# Altium schematic sheet mcu.SchDoc
size A3
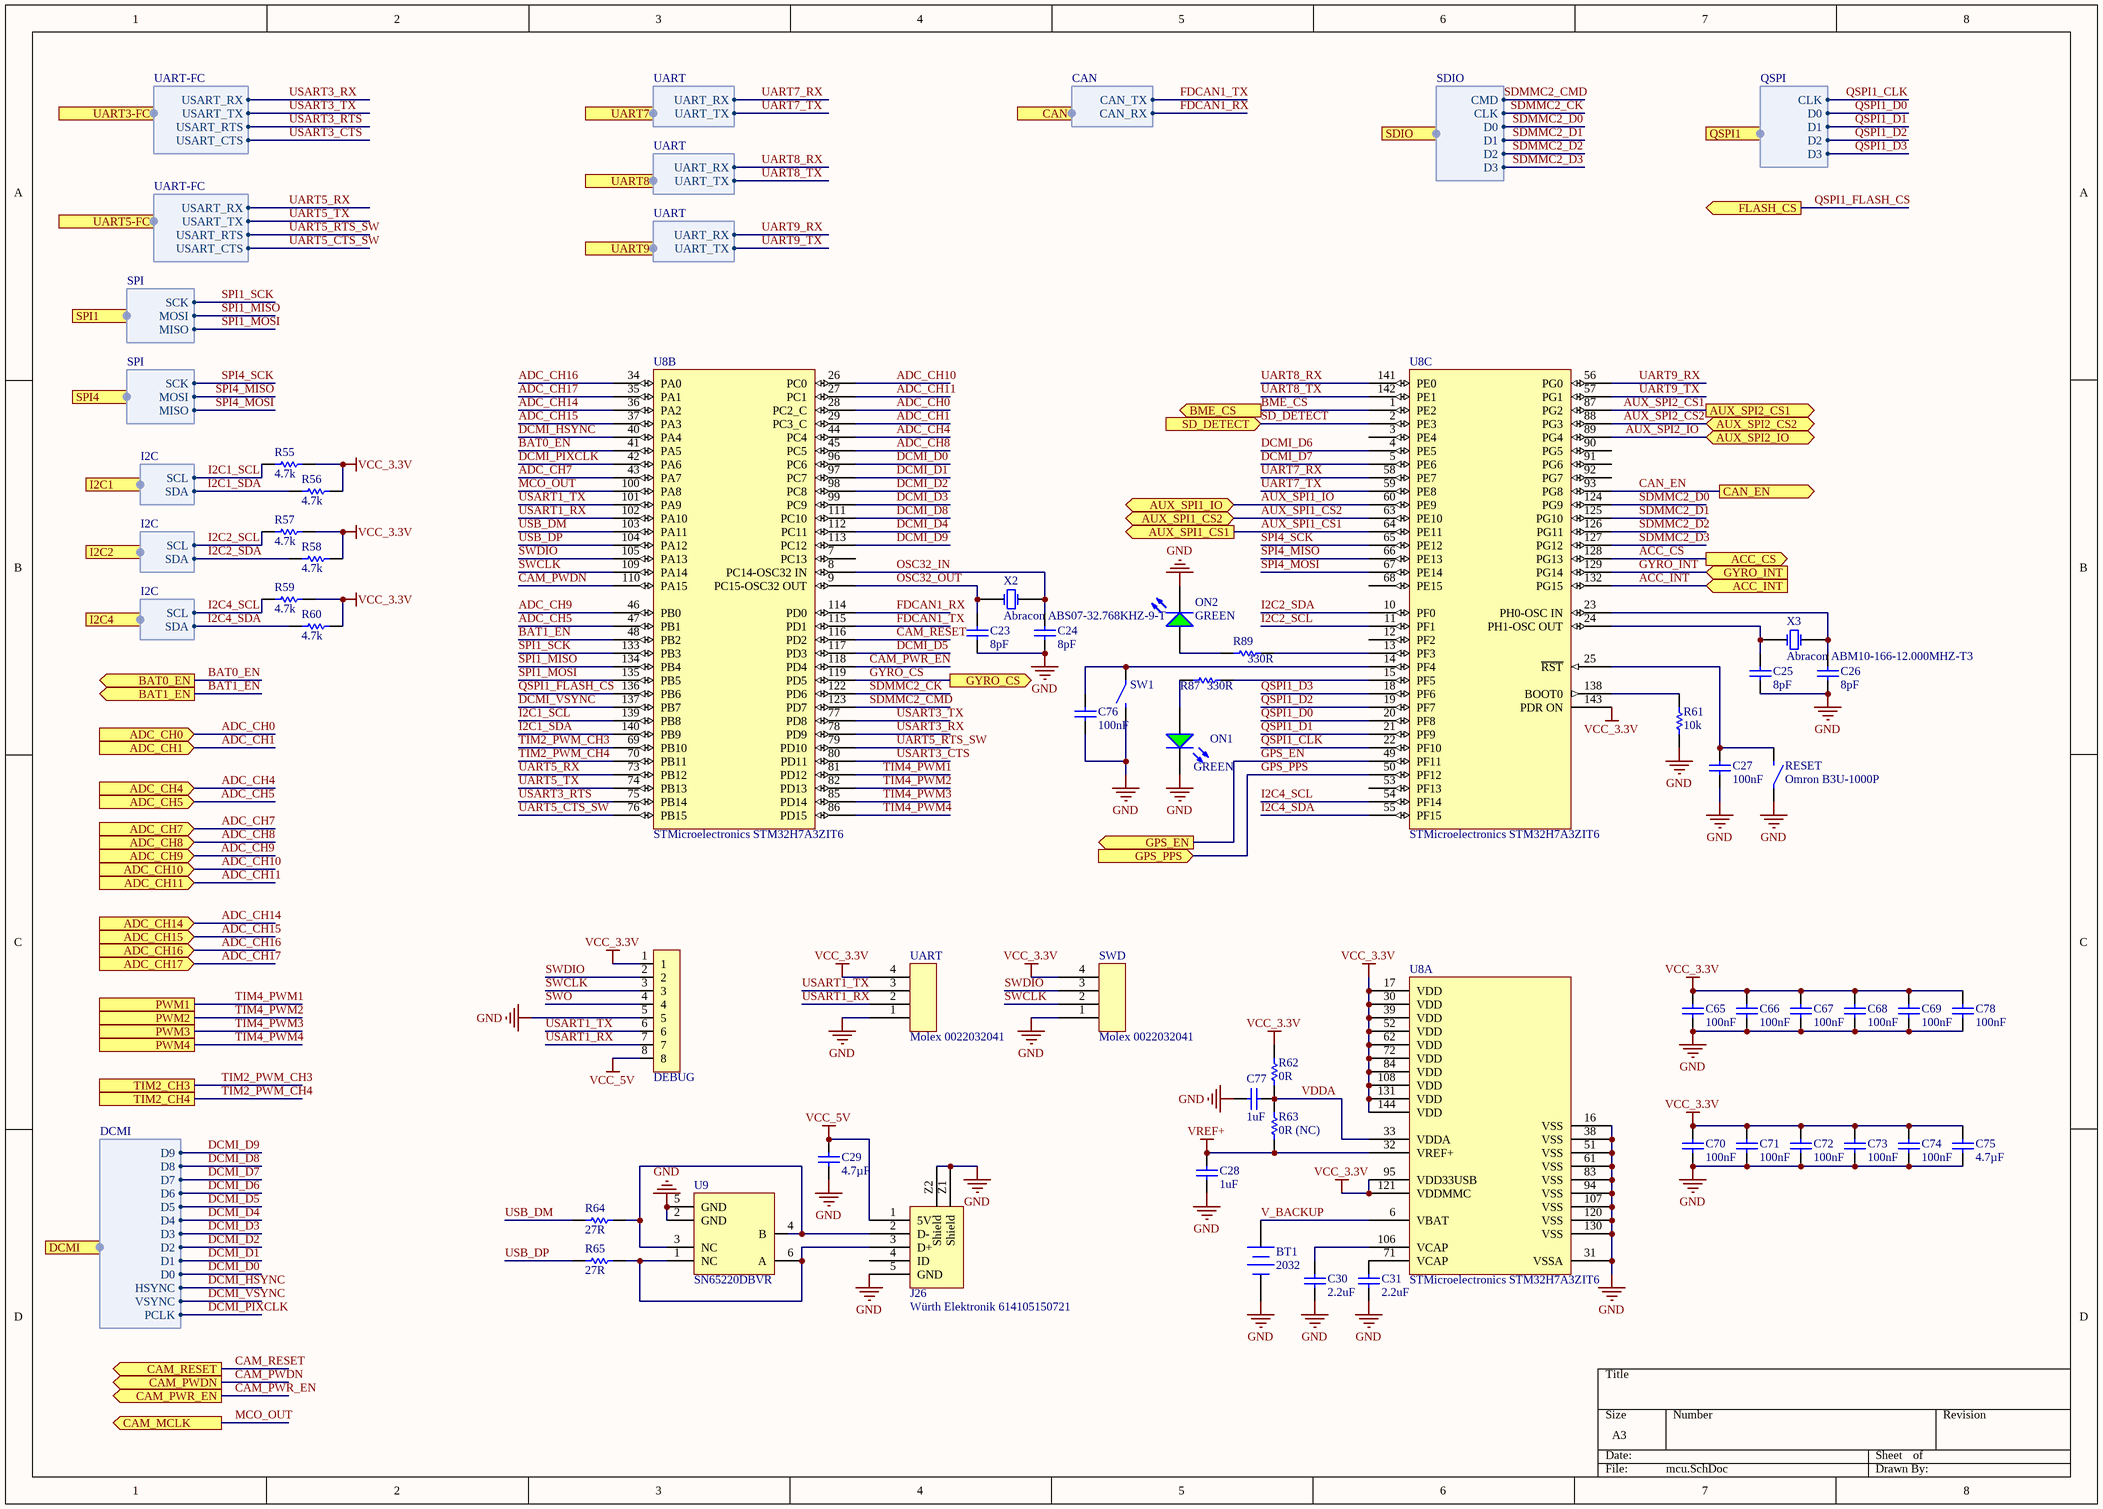
[diagram p0: mcu.SchDoc]

## Parts
BT1  2032  [PCB-u4kor45r34oj4lfal23t-1]
C23  8pF  [CAPC1005X55X25NL05T10]
C24  8pF  [CAPC1005X55X25NL05T10]
C25  8pF  [CAPC1005X55X25NL05T10]
C26  8pF  [CAPC1005X55X25NL05T10]
C27  100nF  [CAPC1005X56X25NL10T15]
C28  1uF  [CAPC1005X60X30LL05T10]
C29  4.7µF  [CAPC1608X90X35NL15T15]
C30  2.2uF  [CAPC1005X56X25LL10T15]
C31  2.2uF  [CAPC1005X56X25LL10T15]
C65  100nF  [CAPC1005X56X25NL10T15]
C66  100nF  [CAPC1005X56X25NL10T15]
C67  100nF  [CAPC1005X56X25NL10T15]
C68  100nF  [CAPC1005X56X25NL10T15]
C69  100nF  [CAPC1005X56X25NL10T15]
C70  100nF  [CAPC1005X56X25NL10T15]
C71  100nF  [CAPC1005X56X25NL10T15]
C72  100nF  [CAPC1005X56X25NL10T15]
C73  100nF  [CAPC1005X56X25NL10T15]
C74  100nF  [CAPC1005X56X25NL10T15]
C75  4.7µF  [CAPC1608X90X35NL15T15]
C76  100nF  [CAPC1005X56X25NL10T15]
C77  1uF  [CAPC1005X60X30LL05T10]
C78  100nF  [CAPC1005X56X25NL10T15]
DEBUG  FCI HLW8R-2C7LF  [PCB-9fz4gdy3o615agpn7s9f-1]  (value not drawn)
J26  Würth Elektronik 614105150721  [USB connector B]
ON1  GREEN  [LED-0603_D]
ON2  GREEN  [LED-0603_D]
R55  4.7k  [RESC1005X40X25NL10T10]
R56  4.7k  [RESC1005X40X25NL10T10]
R57  4.7k  [RESC1005X40X25NL10T10]
R58  4.7k  [RESC1005X40X25NL10T10]
R59  4.7k  [RESC1005X40X25NL10T10]
R60  4.7k  [RESC1005X40X25NL10T10]
R61  10k  [RESC1005X40X25NL05T10]
R62  0R  [PCB-azzhouwj1h0sqqpj65ny-1]
R63  0R (NC)  [PCB-azzhouwj1h0sqqpj65ny-1]
R64  27R  [RESC1005X40X25NL05T05]
R65  27R  [RESC1005X40X25NL05T05]
R87  330R  [PCB-gqq469mmsoijq124jywu-1]
R89  330R  [PCB-gqq469mmsoijq124jywu-1]
RESET  Omron B3U-1000P  [PCB-a8ildroimidtkya2dspy-1]
SW1  Omron B3U-1000P  [PCB-a8ildroimidtkya2dspy-1]  (value not drawn)
SWD  Molex 0022032041  [PCB-w7fgx0p37qyww1etoafk-1]
U8  STMicroelectronics STM32H7A3ZIT6  [PCB-qnuz4odb3kjwuv0h32wq-1]  (parts A,B,C of 3)
U9  SN65220DBVR  [DBV6_M]
UART  Molex 0022032041  [PCB-w7fgx0p37qyww1etoafk-1]
X2  Abracon ABS07-32.768KHZ-9-T  [CAPC3215X09N]
X3  Abracon ABM10-166-12.000MHZ-T3  [PCBComponent_1 - duplicate]

## Ports
ACC_CS (out), ACC_INT (in), ADC_CH0 (in), ADC_CH1 (in), ADC_CH4 (in), ADC_CH5 (in), ADC_CH7 (in), ADC_CH8 (in), ADC_CH9 (in), ADC_CH10 (in), ADC_CH11 (in), ADC_CH14 (in), ADC_CH15 (in), ADC_CH16 (in), ADC_CH17 (in), AUX_SPI1_CS1 (out), AUX_SPI1_CS2 (bidir), AUX_SPI1_IO (bidir), AUX_SPI2_CS1 (out), AUX_SPI2_CS2 (bidir), AUX_SPI2_IO (bidir), BAT0_EN (out), BAT1_EN (out), BME_CS (out), CAM_MCLK (out), CAM_PWDN (out), CAM_PWR_EN (out), CAM_RESET (out), CAN (harness CAN), CAN_EN (out), DCMI (harness DCMI), FLASH_CS (out), GPS_EN (out), GPS_PPS (in), GYRO_CS (out), GYRO_INT (in), I2C1 (harness I2C), I2C2 (harness I2C), I2C4 (harness I2C), PWM1, PWM2, PWM3, PWM4, QSPI1 (harness QSPI), SD_DETECT (in), SDIO (harness SDIO), SPI1 (harness SPI), SPI4 (harness SPI), TIM2_CH3, TIM2_CH4, UART3-FC (harness UART-FC), UART5-FC (harness UART-FC), UART7 (harness UART), UART8 (harness UART), UART9 (harness UART)

## Harnesses
DCMI: PCLK, VSYNC, HSYNC, D0, D1, D2, D3, D4, D5, D6, D7, D8, D9
I2C: SCL, SDA
SPI: MOSI, MISO, SCK
UART-FC: USART_TX, USART_RX, USART_CTS, USART_RTS
UART: UART_TX, UART_RX
CAN: CAN_TX, CAN_RX
SDIO: CLK, CMD, D0, D1, D2, D3
QSPI: CLK, D0, D1, D2, D3

## Nets
GND: BT1.2(-) C23.2 C24.2 C25.2 C26.2 C27.1 C28.1 C29.2 C30.1 C31.1 C65.2 C66.2 C67.2 C68.2 C69.2 C70.2 C71.2 C72.2 C73.2 C74.2 C75.1 C76.1 C77.2 C78.2 DEBUG.5 J26.5(GND) J26.Z1(Shield) J26.Z2(Shield) ON1.C ON2.C R61.1 RESET.1 SW1.2 SWD.1 U8.16(VSS) U8.31(VSSA) U8.38(VSS) U8.51(VSS) U8.61(VSS) U8.83(VSS) U8.94(VSS) U8.107(VSS) U8.120(VSS) U8.130(VSS) U9.2(GND) U9.5(GND) UART.1
VCC_3.3V: C65.1 C66.1 C67.1 C68.1 C69.1 C70.1 C71.1 C72.1 C73.1 C74.1 C75.2 C78.1 DEBUG.1 R55.2 R56.2 R57.2 R58.2 R59.2 R60.2 R62.2 SWD.4 U8.17(VDD) U8.30(VDD) U8.39(VDD) U8.52(VDD) U8.62(VDD) U8.72(VDD) U8.84(VDD) U8.95(VDD33USB) U8.108(VDD) U8.121(VDDMMC) U8.131(VDD) U8.143(PDR_ON) U8.144(VDD) UART.4
VCC_5V: C29.1 DEBUG.8 J26.1(5V)
VREF+: C28.2 R63.2 U8.32(VREF+)
ACC_CS: U8.128(PG13) ; port ACC_CS
ACC_INT: U8.132(PG15) ; port ACC_INT
ADC_CH0: U8.28(PC2_C) ; port ADC_CH0
ADC_CH1: U8.29(PC3_C) ; port ADC_CH1
ADC_CH4: U8.44(PC4) ; port ADC_CH4
ADC_CH5: U8.47(PB1) ; port ADC_CH5
ADC_CH7: U8.43(PA7) ; port ADC_CH7
ADC_CH8: U8.45(PC5) ; port ADC_CH8
ADC_CH9: U8.46(PB0) ; port ADC_CH9
ADC_CH10: U8.26(PC0) ; port ADC_CH10
ADC_CH11: U8.27(PC1) ; port ADC_CH11
ADC_CH14: U8.36(PA2) ; port ADC_CH14
ADC_CH15: U8.37(PA3) ; port ADC_CH15
ADC_CH16: U8.34(PA0) ; port ADC_CH16
ADC_CH17: U8.35(PA1) ; port ADC_CH17
AUX_SPI1_CS1: U8.64(PE11) ; port AUX_SPI1_CS1
AUX_SPI1_CS2: U8.63(PE10) ; port AUX_SPI1_CS2
AUX_SPI1_IO: U8.60(PE9) ; port AUX_SPI1_IO
AUX_SPI2_CS1: U8.87(PG2) ; port AUX_SPI2_CS1
AUX_SPI2_CS2: U8.88(PG3) ; port AUX_SPI2_CS2
AUX_SPI2_IO: U8.89(PG4) ; port AUX_SPI2_IO
BAT0_EN: U8.41(PA5) ; port BAT0_EN
BAT1_EN: U8.48(PB2) ; port BAT1_EN
BME_CS: U8.1(PE2) ; port BME_CS
CAM_PWDN: U8.110(PA15) ; port CAM_PWDN
CAM_PWR_EN: U8.118(PD4) ; port CAM_PWR_EN
CAM_RESET: U8.116(PD2) ; port CAM_RESET
CAN_EN: U8.93(PG8) ; port CAN_EN
DCMI_D0: U8.96(PC6) ; port DCMI.D0
DCMI_D1: U8.97(PC7) ; port DCMI.D1
DCMI_D2: U8.98(PC8) ; port DCMI.D2
DCMI_D3: U8.99(PC9) ; port DCMI.D3
DCMI_D4: U8.112(PC11) ; port DCMI.D4
DCMI_D5: U8.117(PD3) ; port DCMI.D5
DCMI_D6: U8.4(PE5) ; port DCMI.D6
DCMI_D7: U8.5(PE6) ; port DCMI.D7
DCMI_D8: U8.111(PC10) ; port DCMI.D8
DCMI_D9: U8.113(PC12) ; port DCMI.D9
DCMI_HSYNC: U8.40(PA4) ; port DCMI.HSYNC
DCMI_PIXCLK: U8.42(PA6) ; port DCMI.PCLK
DCMI_VSYNC: U8.137(PB7) ; port DCMI.VSYNC
FDCAN1_RX: U8.114(PD0) ; port CAN.CAN_RX
FDCAN1_TX: U8.115(PD1) ; port CAN.CAN_TX
GPS_EN: U8.49(PF11) ; port GPS_EN
GPS_PPS: U8.50(PF12) ; port GPS_PPS
GYRO_CS: U8.119(PD5) ; port GYRO_CS
GYRO_INT: U8.129(PG14) ; port GYRO_INT
I2C1_SCL: R55.1 U8.139(PB8) ; port I2C1.SCL
I2C1_SDA: R56.1 U8.140(PB9) ; port I2C1.SDA
I2C2_SCL: R57.1 U8.11(PF1) ; port I2C2.SCL
I2C2_SDA: R58.1 U8.10(PF0) ; port I2C2.SDA
I2C4_SCL: R59.1 U8.54(PF14) ; port I2C4.SCL
I2C4_SDA: R60.1 U8.55(PF15) ; port I2C4.SDA
MCO_OUT: U8.100(PA8) ; port CAM_MCLK
OSC32_IN: C24.1 U8.8(PC14-OSC32_IN) X2.2(X2)
OSC32_OUT: C23.1 U8.9(PC15-OSC32_OUT) X2.1(X1)
QSPI1_CLK: U8.22(PF10) ; port QSPI1.CLK
QSPI1_D0: U8.20(PF8) ; port QSPI1.D0
QSPI1_D1: U8.21(PF9) ; port QSPI1.D1
QSPI1_D2: U8.19(PF7) ; port QSPI1.D2
QSPI1_D3: U8.18(PF6) ; port QSPI1.D3
QSPI1_FLASH_CS: U8.136(PB6) ; port FLASH_CS
SD_DETECT: U8.2(PE3) ; port SD_DETECT
SDMMC2_CK: U8.122(PD6) ; port SDIO.CLK
SDMMC2_CMD: U8.123(PD7) ; port SDIO.CMD
SDMMC2_D0: U8.124(PG9) ; port SDIO.D0
SDMMC2_D1: U8.125(PG10) ; port SDIO.D1
SDMMC2_D2: U8.126(PG11) ; port SDIO.D2
SDMMC2_D3: U8.127(PG12) ; port SDIO.D3
SPI1_MISO: U8.134(PB4) ; port SPI1.MOSI
SPI1_MOSI: U8.135(PB5) ; port SPI1.MISO
SPI1_SCK: U8.133(PB3) ; port SPI1.SCK
SPI4_MISO: U8.66(PE13) ; port SPI4.MOSI
SPI4_MOSI: U8.67(PE14) ; port SPI4.MISO
SPI4_SCK: U8.65(PE12) ; port SPI4.SCK
SWCLK: DEBUG.3 SWD.2 U8.109(PA14)
SWDIO: DEBUG.2 SWD.3 U8.105(PA13)
SWO: DEBUG.4
TIM2_PWM_CH3: U8.69(PB10) ; port TIM2_CH3
TIM2_PWM_CH4: U8.70(PB11) ; port TIM2_CH4
TIM4_PWM1: U8.81(PD12) ; port PWM1
TIM4_PWM2: U8.82(PD13) ; port PWM2
TIM4_PWM3: U8.85(PD14) ; port PWM3
TIM4_PWM4: U8.86(PD15) ; port PWM4
UART5_CTS_SW: U8.76(PB15) ; port UART5-FC.USART_CTS
UART5_RTS_SW: U8.79(PD10) ; port UART5-FC.USART_RTS
UART5_RX: U8.73(PB12) ; port UART5-FC.USART_RX
UART5_TX: U8.74(PB13) ; port UART5-FC.USART_TX
UART7_RX: U8.58(PE7) ; port UART7.UART_RX
UART7_TX: U8.59(PE8) ; port UART7.UART_TX
UART8_RX: U8.141(PE0) ; port UART8.UART_RX
UART8_TX: U8.142(PE1) ; port UART8.UART_TX
UART9_RX: U8.56(PG0) ; port UART9.UART_RX
UART9_TX: U8.57(PG1) ; port UART9.UART_TX
USART1_RX: DEBUG.7 U8.102(PA10) UART.2
USART1_TX: DEBUG.6 U8.101(PA9) UART.3
USART3_CTS: U8.80(PD11) ; port UART3-FC.USART_CTS
USART3_RTS: U8.75(PB14) ; port UART3-FC.USART_RTS
USART3_RX: U8.78(PD9) ; port UART3-FC.USART_RX
USART3_TX: U8.77(PD8) ; port UART3-FC.USART_TX
USB_DM: R64.1 U8.103(PA11)
USB_DP: R65.1 U8.104(PA12)
V_BACKUP: BT1.1(+) U8.6(VBAT)
VDDA: C77.1 R62.1 R63.1 U8.33(VDDA)
NetC25_1: C25.1 U8.24(PH1-OSC_OUT) X3.3(X2)
NetC26_1: C26.1 U8.23(PH0-OSC_IN) X3.1(X1)
NetC27_2: C27.2 RESET.2 U8.25(~{RST})
NetC30_2: C30.2 U8.106(VCAP)
NetC31_2: C31.2 U8.71(VCAP)
NetC76_2: C76.2 SW1.1 U8.14(PF4)
NetJ26_2: J26.2(D-) R64.2 U9.3(NC) U9.4(B)
NetJ26_3: J26.3(D+) R65.2 U9.1(NC) U9.6(A)
NetON1_A: ON1.A R87.2
NetON2_A: ON2.A R89.2
NetR61_2: R61.2 U8.138(BOOT0)
NetR87_1: R87.1 U8.15(PF5)
NetR89_1: R89.1 U8.13(PF3)

Not connected (* = marked no-connect by the designer): J26 4(ID); U8 3(PE4) 7(PC13) 12(PF2) 53(PF13) 68(PE15) 90(PG5) 91(PG6) 92(PG7)

## Library data of the parts
BT1 = CMP-19301741-10: Coin Cell Battery Holders 20MM (2032) SMT CELL HOLDER
C23-C26 = CMP-137744-2: CAP CER 8PF 50V NP0 0402; Manufacturer Part Number: GJM1555C1H8R0WB01D; Capacitance: 8e-12 F; Dielectric Characteristic: C0G/NP0; Voltage Rating (DC): 50.0 V; Octopart Url: https://octopart.com/gjm1555c1h8r0wb01d-murata-18142773; OctopartID: 2584ed9ad6d7fa43; RoHS: Compliant; Size-Length: 0.001 m; Size-Thickness: 0.0005 m; Size-Width: 0.0005 m
C27 C65-C74 C76 C78 = CMP-bf2276a55d9a60e5-19: Ceramic capacitor SMD-0402 100nF /16V X7R# K +-10%, Samsung, RoHS; Dielectric Characteristic: X7R; Lead-Free Status: Lead Free; Mounting Style: Surface Mount; Capacitance: 100 nF; Case/Package: 0402; OctopartID: 0755ced2c795d892
C28 C77 = CMP-8752271-2: Cap Ceramic 1uF 10V X5R 10% SMD 0402 85C Paper T/R; Manufacturer Part Number: C0402C105K8PACTU; Capacitance: 1e-06 F; Lead-Free Status: Lead Free; Voltage Rating (DC): 10.0 V; Capacitance Tolerance: ±10%; Case/Package: 0402; Dielectric Characteristic: X5R; Dielectric Material: Ceramic; Mounting Style: Surface Mount; Octopart Url: https://octopart.com/c0402c105k8pac7867-kemet-1869581; OctopartID: 270dee1b8566f8ca; RoHS: Compliant
C29 C75 = CMP-147010-6: 0603 4.7 uF 10 V ±10 % Tolerance X5R SMT Multilayer Ceramic Capacitor; Voltage Rating (DC): 10.0 V; Capacitance Tolerance: ±10%; Lead-Free Status: Lead Free; Capacitance: 4.70 µF; Operating Temperature: -55.0 °C to 85.0 °C; Dielectric Characteristic: X5R; OctopartID: 876b4eec68d658ac; Octopart URL: https://octopart.com/cc0603krx5r6bb475-yageo-9292507; Number of Pins: 2; Mounting Style: Surface Mount; RoHS: Compliant
C30 C31 = CMP-954275-2: AVX   04026D225KAT2A   CAP, MLCC, X5R, 2.2UF, 6.3V, 0402; Capacitance: 2.2e-06 F; Capacitance Tolerance: ±10%; Lead-Free Status: Lead Free; Manufacturer Part Number: 04026D225KAT2A; Case/Package: 0402; Dielectric Characteristic: X5R; Mounting Style: Surface Mount; Number of Pins: 2; Octopart Url: https://octopart.com/04026d225kat2a-avx+interconnect+%2F+elco-18781101; OctopartID: b6d37ec700186914; REACH SVHC Compliance: No SVHC; RoHS: Compliant; Voltage Rating (DC): 6.3 V
DEBUG = CMP-90945c3aea634f53-1: FPC Connector; 0.5mm pitch dual contactback flip FPC; 8pos; Contact Material: Copper Alloy; RoHS: Compliant; Octopart URL: https://octopart.com/2328702-8-te+connectivity-94658449
J26 = CMP-3a62f04b53f2e5a5-1: Vertical Through Hole; Ver 2.0 Micro USB Connector Socket; 30 V ac; 1.8A WR-COM; Gender: Female; Number of Contacts: 5; Operating Voltage: 30.0 V; Current Rating: 1.80 A; Contact Material: Copper Alloy; RoHS: Compliant; Mounting Style: Through Hole; OctopartID: 3a62f04b53f2e5a5; Contact Plating: Gold; Orientation: Vertical; Operating Temperature: -40.0 °C (min); Octopart URL: https://octopart.com/614105150621-w%C3%BCrth+elektronik-52645110
ON1 ON2 = CMP-65d2acda0cfcba15-1.A.3: Super Ultra Green 0603 1.6 x 0.8 mm 140° Diffused 45 mcd 2.2 V PCB Chip SMT LED; Manufacturer Part Number: SML-LX0603SUGW-TR; Forward Voltage: 2.20 V; Wavelength: 574 nm; Lead-Free Status: Lead Free; Luminous Intensity: 45.0 mcd; Number of Pins: 2; Packaging: Cut Tape (CT), Tape & Reel (TR); Seller Landing  Url: https://octopart-clicks.com/click/track?country=US&ak=8157f166&sig=056782a&sid=459&ppid=150600&vpid=1262106&ct=offers; Color: Green; Size-Width: 1.60 mm; Viewing Angle: 140 °; Octopart Url: http://octopart.com/sml-lx0603sugw-tr-lumex-150600; RoHS: Compliant
R55-R60 = CMP-3660836-2: Thick Film Resistors - SMD 1/16watt 4.7Kohms 1%; Manufacturer Part Number: RK73H1ETTP4701F; Lead-Free Status: Lead Free; Power Rating: 0.063 W; Resistance: 4700.0 Ω; Case/Package: 0402; Octopart Url: https://octopart.com/rk73h1ettp4701f-koa+speer-7463891; OctopartID: 60e3a998a656bf24; Resistance Tolerance: ±1%; RoHS: Compliant
R61 = CMP-3661304-2: Thick Film Resistors - SMD 10K OHM 1%; Manufacturer Part Number: RC0402FR-1310KL; Lead-Free Status: Lead Free; Power Rating: 0.0625 W; Resistance: 10000.0 Ω; Voltage Rating (DC): 50.0 V; Case/Package: 0402; Mounting Style: Surface Mount; Number of Pins: 2; Octopart Url: https://octopart.com/rc0402fr-1310kl-yageo-42863452; OctopartID: f5673ee3db5d2aa0; Packaging: Cut Tape (CT); Resistance Tolerance: ±1%; RoHS: Compliant; Size-Length: 0.001 m
R62 R63 = CMP-13527731-11: RC Series 0402 0.063 W 0 Ohms Jumper Surface Mount Thick Film Chip Resistor; Temperature Coefficient: -250 ppm/°C to 250 ppm/°C; RoHS: Compliant; Packaging: Tape & Reel; Number of Pins: 2; Size-Width: 500 µm; OctopartID: 3abff0f8c341e578
R64 R65 = CMP-3855807-2: RES SMD 27 OHM 1% 1/16W 0402; Manufacturer Part Number: CRCW040227R0FKED; Lead-Free Status: Lead Free; Power Rating: 0.063 W; Resistance: 27.0 Ω; Voltage Rating (DC): 50.0 V; Case/Package: 0402; Mounting Style: Surface Mount; Number of Pins: 2; Octopart Url: https://octopart.com/crcw040227r0fked-vishay-39846192; OctopartID: 351cfe76114aeadb; REACH SVHC Compliance: No SVHC; Resistance Tolerance: ±1%; RoHS: Compliant; Size-Height: 0.00035 m; Size-Length: 0.001 m; Size-Width: 0.0005 m
R87 R89 = CMP-1852941-7: Res General Purpose Thick Film 0603 330 Ohm 5% 1/10W ±100ppm/°C Molded SMD Paper T/R; Manufacturer Part Number: RC0603JR-07330RL; Case/Package (SI): 1608; Temperature Coefficient: -100 ppm/°C to 100 ppm/°C; Resistance: 330 Ω; Power Rating: 100 mW; Octopart URL: https://octopart.com/rc0603jr-07330rl-yageo-39803615; Size-Height: 450 µm; RoHS: Compliant; Resistance Tolerance: ±5%; Packaging: Tape & Reel; Number of Pins: 2; Mounting Style: Surface Mount; Operating Temperature: 155 °C (max); Size-Width: 800 µm; OctopartID: 0b82c0d7743bd445; Case/Package: 0603
RESET SW1 = CMP-2198857-15: Switch Tactile N.O. SPST Round Button Gull Wing 0.05A 12VDC 1.5N SMD Embossed T/R; Contact Resistance: 100 m?; Lead-Free Status: Lead Free; Actuator Type: Top Plunger; Contacts Type: SPST-NO; RoHS: Compliant; Octopart URL: http://octopart.com/b3u-1000p-omron-1057357; REACH SVHC Compliance: No SVHC; Orientation: Vertical; Insulation Resistance: 100 M?; Mounting Style: Surface Mount; Manufacturer Part Number: B3U-1000P; OctopartID: 24bceda62397fb7b
SWD UART = CMP-4df18464dcf59236-7: Conn Unshrouded Header HDR 4 POS 2.54mm Solder ST Thru-Hole KK?? Bag
U8 = CMP-79c4b6aa4662a603-3: STM32H Series 2 MB Flash 1.4 MB SRAM 280 MHz 32-Bit Microcontroller - LQFP-144; OctopartID: 79c4b6aa4662a603; Manufacturer Part Number: STM32H7A3ZIT6; Lifecycle Status: Active; Octopart URL: https://octopart.com/stm32h7a3zit6-stmicroelectronics-107223744
U9 = CMP-13588204-2: Single Universal Serial Bus Port Transient Suppressor, 2 Channels, -40 to +85 degC, 6-pin SOT-23 (DBV), Green (RoHS & no Sb/Br); Breakdown Voltage: 7.0 V; Capacitance: 3.5e-11 F; Lead-Free Status: Lead Free; Number of Channels: 2; Operating Voltage: 6.0 V; Power Dissipation: 0.385 W; Manufacturer Part Number: SN65220DBVR; Case/Package: SOT-23; Lifecycle Status: Active; Mounting Style: Surface Mount; Number of Pins: 6; Octopart Url: https://octopart.com/sn65220dbvr-texas+instruments-519897; OctopartID: 691ea013a2a1b6d9; REACH SVHC Compliance: No SVHC; RoHS: Compliant
X2 = CMP-ab256225872974e2-3: ABS07 Series 32.768 kHz ±20 ppm 9 pF -40 to +85 °C SMT Low Profile Crystal; Lead-Free Status: Lead Free; Load Capacitance: 9.00 pF; OctopartID: ab256225872974e2; RoHS: Compliant
X3 = CMP-ad1c606f542d72db-7: Crystal 12.00mhz 8pf Low Esr Smd 2.5x2.0